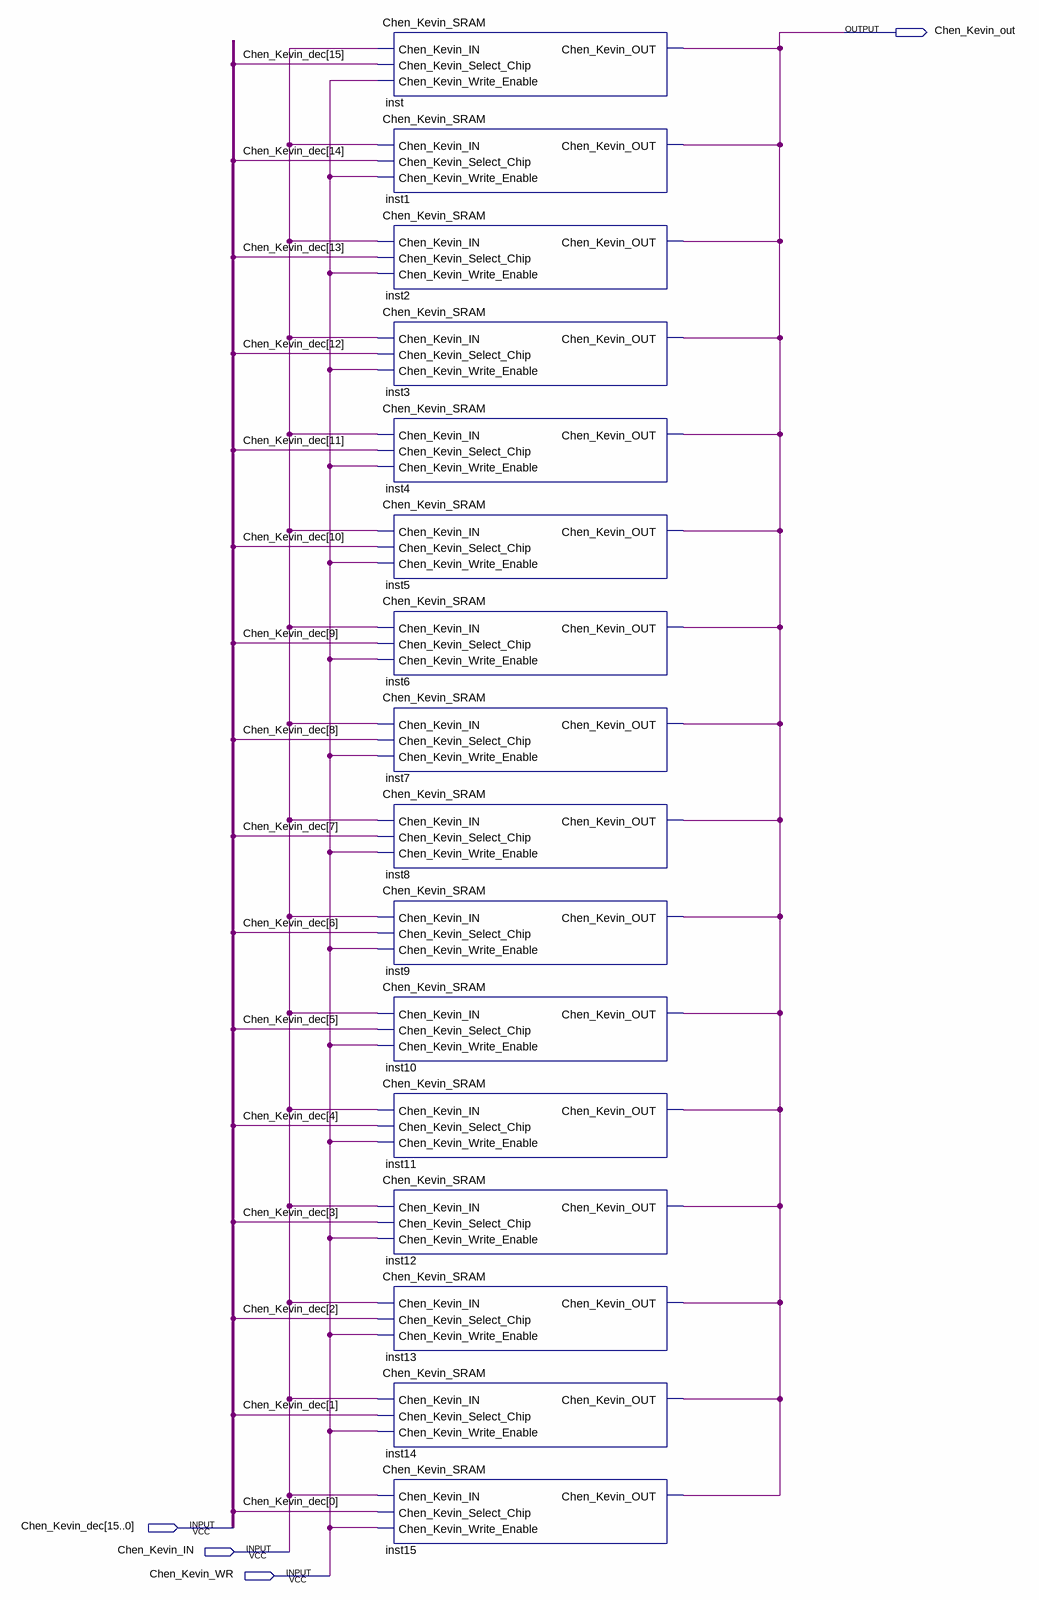
[diagram p0: schematic sheet]
// Quartus schematic Chen_Kevin_16x1SRAM.bdf as structural Verilog: 16 symbols, 4 pins
module Chen_Kevin_16x1SRAM (
  input  [15:0] Chen_Kevin_dec,
  input  Chen_Kevin_IN,
  input  Chen_Kevin_WR,
  output Chen_Kevin_out
);

  Chen_Kevin_SRAM inst (
    .Chen_Kevin_IN(Chen_Kevin_IN), .Chen_Kevin_Select_Chip(Chen_Kevin_dec[15]),
    .Chen_Kevin_Write_Enable(Chen_Kevin_WR), .Chen_Kevin_OUT(Chen_Kevin_out));
  Chen_Kevin_SRAM inst1 (
    .Chen_Kevin_IN(Chen_Kevin_IN), .Chen_Kevin_Select_Chip(Chen_Kevin_dec[14]),
    .Chen_Kevin_Write_Enable(Chen_Kevin_WR), .Chen_Kevin_OUT(Chen_Kevin_out));
  Chen_Kevin_SRAM inst2 (
    .Chen_Kevin_IN(Chen_Kevin_IN), .Chen_Kevin_Select_Chip(Chen_Kevin_dec[13]),
    .Chen_Kevin_Write_Enable(Chen_Kevin_WR), .Chen_Kevin_OUT(Chen_Kevin_out));
  Chen_Kevin_SRAM inst3 (
    .Chen_Kevin_IN(Chen_Kevin_IN), .Chen_Kevin_Select_Chip(Chen_Kevin_dec[12]),
    .Chen_Kevin_Write_Enable(Chen_Kevin_WR), .Chen_Kevin_OUT(Chen_Kevin_out));
  Chen_Kevin_SRAM inst4 (
    .Chen_Kevin_IN(Chen_Kevin_IN), .Chen_Kevin_Select_Chip(Chen_Kevin_dec[11]),
    .Chen_Kevin_Write_Enable(Chen_Kevin_WR), .Chen_Kevin_OUT(Chen_Kevin_out));
  Chen_Kevin_SRAM inst5 (
    .Chen_Kevin_IN(Chen_Kevin_IN), .Chen_Kevin_Select_Chip(Chen_Kevin_dec[10]),
    .Chen_Kevin_Write_Enable(Chen_Kevin_WR), .Chen_Kevin_OUT(Chen_Kevin_out));
  Chen_Kevin_SRAM inst6 (
    .Chen_Kevin_IN(Chen_Kevin_IN), .Chen_Kevin_Select_Chip(Chen_Kevin_dec[9]),
    .Chen_Kevin_Write_Enable(Chen_Kevin_WR), .Chen_Kevin_OUT(Chen_Kevin_out));
  Chen_Kevin_SRAM inst7 (
    .Chen_Kevin_IN(Chen_Kevin_IN), .Chen_Kevin_Select_Chip(Chen_Kevin_dec[8]),
    .Chen_Kevin_Write_Enable(Chen_Kevin_WR), .Chen_Kevin_OUT(Chen_Kevin_out));
  Chen_Kevin_SRAM inst8 (
    .Chen_Kevin_IN(Chen_Kevin_IN), .Chen_Kevin_Select_Chip(Chen_Kevin_dec[7]),
    .Chen_Kevin_Write_Enable(Chen_Kevin_WR), .Chen_Kevin_OUT(Chen_Kevin_out));
  Chen_Kevin_SRAM inst9 (
    .Chen_Kevin_IN(Chen_Kevin_IN), .Chen_Kevin_Select_Chip(Chen_Kevin_dec[6]),
    .Chen_Kevin_Write_Enable(Chen_Kevin_WR), .Chen_Kevin_OUT(Chen_Kevin_out));
  Chen_Kevin_SRAM inst10 (
    .Chen_Kevin_IN(Chen_Kevin_IN), .Chen_Kevin_Select_Chip(Chen_Kevin_dec[5]),
    .Chen_Kevin_Write_Enable(Chen_Kevin_WR), .Chen_Kevin_OUT(Chen_Kevin_out));
  Chen_Kevin_SRAM inst11 (
    .Chen_Kevin_IN(Chen_Kevin_IN), .Chen_Kevin_Select_Chip(Chen_Kevin_dec[4]),
    .Chen_Kevin_Write_Enable(Chen_Kevin_WR), .Chen_Kevin_OUT(Chen_Kevin_out));
  Chen_Kevin_SRAM inst12 (
    .Chen_Kevin_IN(Chen_Kevin_IN), .Chen_Kevin_Select_Chip(Chen_Kevin_dec[3]),
    .Chen_Kevin_Write_Enable(Chen_Kevin_WR), .Chen_Kevin_OUT(Chen_Kevin_out));
  Chen_Kevin_SRAM inst13 (
    .Chen_Kevin_IN(Chen_Kevin_IN), .Chen_Kevin_Select_Chip(Chen_Kevin_dec[2]),
    .Chen_Kevin_Write_Enable(Chen_Kevin_WR), .Chen_Kevin_OUT(Chen_Kevin_out));
  Chen_Kevin_SRAM inst14 (
    .Chen_Kevin_IN(Chen_Kevin_IN), .Chen_Kevin_Select_Chip(Chen_Kevin_dec[1]),
    .Chen_Kevin_Write_Enable(Chen_Kevin_WR), .Chen_Kevin_OUT(Chen_Kevin_out));
  Chen_Kevin_SRAM inst15 (
    .Chen_Kevin_IN(Chen_Kevin_IN), .Chen_Kevin_Select_Chip(Chen_Kevin_dec[0]),
    .Chen_Kevin_Write_Enable(Chen_Kevin_WR), .Chen_Kevin_OUT(Chen_Kevin_out));
endmodule
